# Altium project CSN_v3.PrjPCB
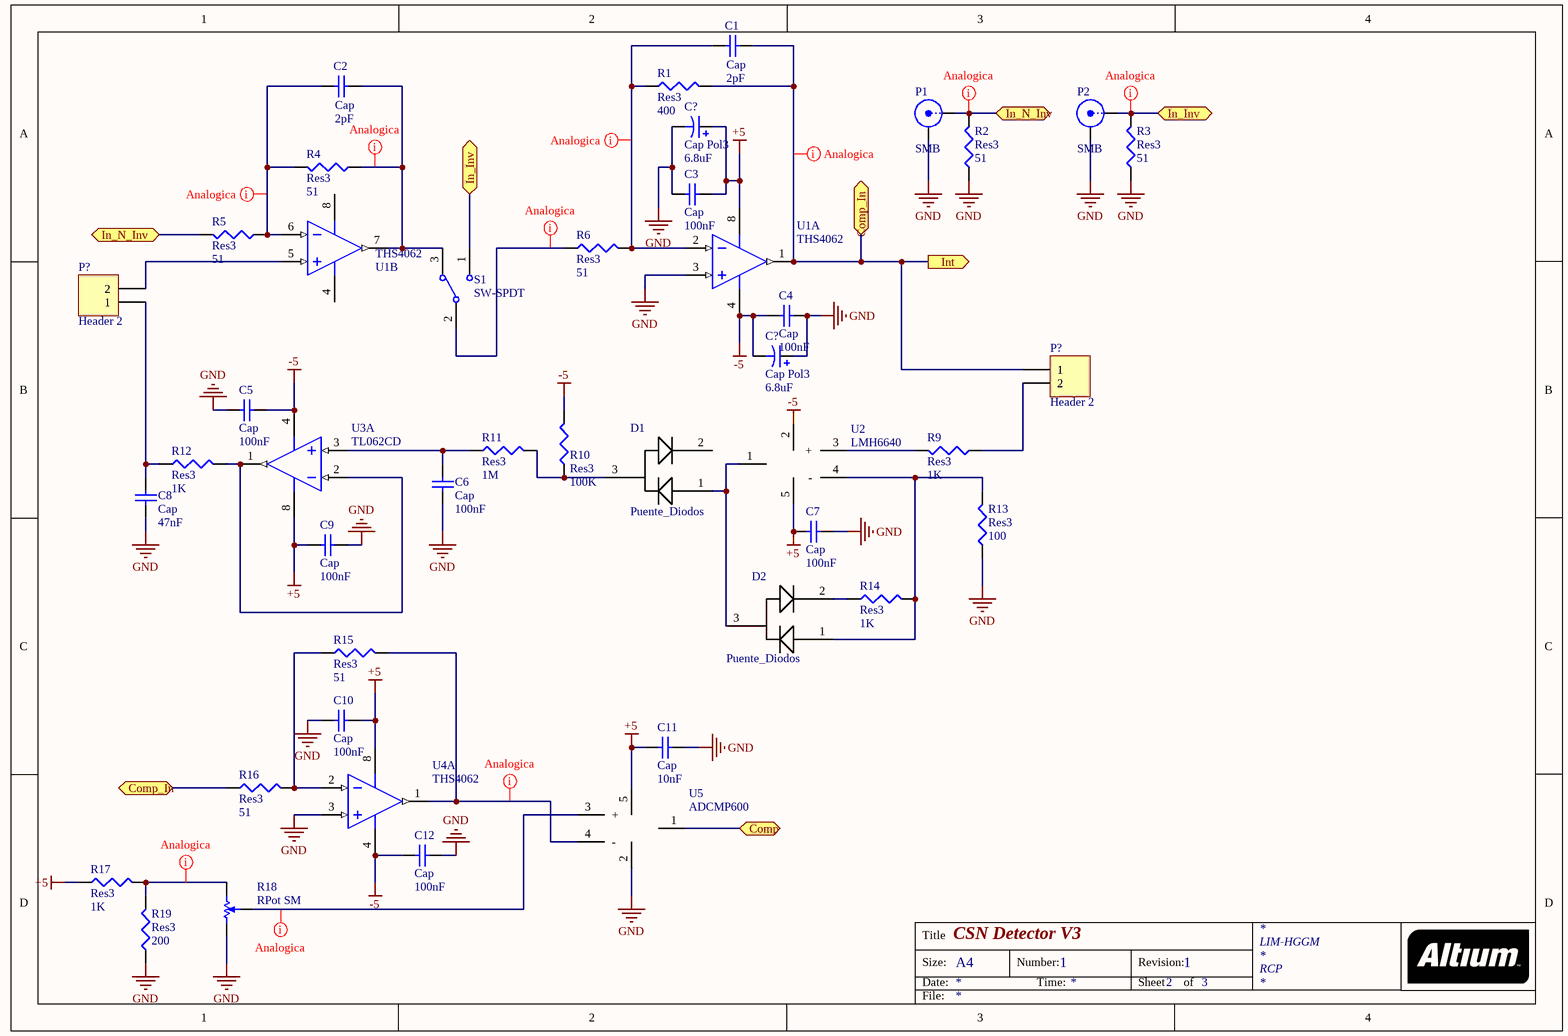
[diagram p0: Entrada_ADC.SchDoc]
3 sheets, 126 parts. Net scope: flat (ports and power ports of the same name join across sheets).
Sheets:
  Entrada_ADC.SchDoc
  Logica_ADC.SchDoc
  Hamamatsu_acond.SchDoc

## Sheet Entrada_ADC.SchDoc: CSN Detector V3
size A4; Author: RCP; CompanyName: LIM-HGM; DrawnBy: RCP; Address1: LIM-HGGM; Address3: RCP; DocumentNumber: 1; Revision: 1; SheetNumber: 2; SheetTotal: 3; PageSetup: Record=PageOptions|CenterHorizontal=True|CenterVertical=True|PrintScale=1.00|XCorrection=1.00|YCorrection=1.00|PrintKind=0|BorderSize=5000000|LeftOffset=0|BottomOffset=0|Orientation=2|PaperLength=1000|PaperWidth=1000|Scale=100|PaperSource=7|PrintQuality=-4|MediaType=1|DitherType=10|PaperKind=A4|PrintScaleMode=1

### Parts
(Parts that share a designator on the sheet are numbered #1, #2 ... from top to bottom, then left to right.)
C1  Cap  value 2pF  [6-0805_N]
C2  Cap  value 2pF  [6-0805_N]
C3  Cap  value 100nF  [6-0805_N]
C4  Cap  value 100nF  [6-0805_N]
C5  Cap  value 100nF  [6-0805_N]
C6  Cap  value 100nF  [6-0805_N]
C7  Cap  value 100nF  [6-0805_N]
C8  Cap  value 47nF  [6-0805_N]
C9  Cap  value 100nF  [6-0805_N]
C10  Cap  value 100nF  [6-0805_N]
C11  Cap  value 10nF  [6-0805_N]
C12  Cap  value 100nF  [6-0805_N]
C?#1  Cap Pol3  value 6.8uF  [C0805]
C?#2  Cap Pol3  value 6.8uF  [C0805]
D1  Puente_Diodos  [SOT-23B_N]
D2  Puente_Diodos  [SOT-23B_N]
P1  SMB  [SMB_V-RJ45]
P2  SMB  [SMB_V-RJ45]
P?#1  Header 2  [HDR1X2]
P?#2  Header 2  [HDR1X2]
R1  Res3  value 400  [6-0805_N]
R2  Res3  value 51  [6-0805_N]
R3  Res3  value 51  [6-0805_N]
R4  Res3  value 51  [6-0805_N]
R5  Res3  value 51  [6-0805_N]
R6  Res3  value 51  [6-0805_N]
R9  Res3  value 1K  [6-0805_N]
R10  Res3  value 100K  [6-0805_N]
R11  Res3  value 1M  [6-0805_N]
R12  Res3  value 1K  [6-0805_N]
R13  Res3  value 100  [6-0805_N]
R14  Res3  value 1K  [6-0805_N]
R15  Res3  value 51  [6-0805_N]
R16  Res3  value 51  [6-0805_N]
R17  Res3  value 1K  [6-0805_N]
R18  RPot SM  [POT4MM-2]
R19  Res3  value 200  [6-0805_N]
S1  SW-SPDT  [HDR1X3]
U1  THS4062  [S8_N]  (parts A,B of 2)
U2#1  LMH6640  [SOT23-5_N]
U3  TL062CD  [S8_N]  (part A of 2)
U4  THS4062  [S8_N]  (part A of 2)
U5#1  ADCMP600  [SOT23-5_N]

### Ports
Comp, Comp_In, In_Inv, In_N_Inv, Int (out)

### Nets
+5: C3.2 C7.1 C9.2 C10.2 C11.1 C?#1.1 R17.1 U1.8(V+) U2#1.5 U3.8(V+) U4.8(V+) U5#1.5
-5: C4.1 C5.1 C12.1 C?#2.2 R10.2 U1.4(V-) U2#1.2 U3.4(V-) U4.4(V-)
GND: C3.1 C4.2 C5.2 C6.2 C7.2 C8.2 C9.1 C10.1 C11.2 C12.2 C?#1.2 C?#2.1 P1.2(Y) P2.2(Y) R2.1 R3.1 R13.1 R18.CCW(-) R19.1 U1.3(IN+) U4.3(IN+) U5#1.2
NetC1_1: C1.1 R1.1 R6.2 U1.2(IN-)
NetC1_2: C1.2 P?#2.1 R1.2 R16.1 U1.1(OUT) ; port Int, port Comp_In
NetC2_1: C2.1 R4.2 R5.1 U1.6(IN-)
NetC2_2: C2.2 R4.1 S1.3 U1.7(OUT)
NetC6_1: C6.1 R11.1 U3.3(IN+)
NetC8_1: C8.1 P?#1.1 R12.1
NetC?#11_2: P1.1(X) R2.2 R5.2 ; port In_N_Inv
NetD1_1: D1.1 D2.3 U2#1.1
NetD1_3: D1.3 R10.1 R11.2
NetD2_1: D2.1 R13.2 R14.2 U2#1.4(-)
NetD2_2: D2.2 R14.1
NetP2_1: P2.1(X) R3.2 S1.1 ; port In_Inv
NetP5_6: U5#1.1 ; port Comp
NetP?#1_2: P?#1.2 U1.5(IN+)
NetP?#2_2: P?#2.2 R9.1
NetR6_1: R6.1 S1.2
NetR9_2: R9.2 U2#1.3(+)
NetR12_2: R12.2 U3.1(OUT) U3.2(IN-)
NetR15_1: R15.1 R16.2 U4.2(IN-)
NetR15_2: R15.2 U4.1(OUT) U5#1.4(-)
NetR17_2: R17.2 R18.CW(+) R19.2
NetR18_W: R18.W U5#1.3(+)

Not connected (* = marked no-connect by the designer): D1 2

### Layout directives
net class analog: NetC1_1, NetC1_2, NetC2_1, NetC2_2, NetC?#11_2, NetP2_1, NetR6_1, NetR15_2, NetR17_2, NetR18_W

### Notes on the sheet
- Title
- Size:
- Date:
- A4
- Number:
- Time:
- Revision:
- Sheet
- of
- File:

### Library data of the parts
C1-C12 = Cap: Capacitor; Published: 8-Jun-2000; LatestRevisionDate: 17-Jul-2002; LatestRevisionNote: Re-released for DXP Platform.; PackageReference: RAD-0.3; Publisher: Altium Limited; PackageDescription: Radial Cap, Thru-Hole; 2 Leads; 0.3 in Pin Spacing
C?#1 C?#2 = Cap Pol3: Polarized Capacitor (Surface Mount); Published: 8-Jun-2000; LatestRevisionDate: 29-May-2009; LatestRevisionNote: IPC-7351 Footprint Added.; PackageReference: C0805; Publisher: Altium Limited; PackageDescription: Chip Capacitor
P1 P2 = SMB: SMB Straight Connector; LatestRevisionDate: 17-Jul-2002; LatestRevisionNote: Re-released for DXP Platform.; Publisher: Altium Limited
P?#1 P?#2 = Header 2: Header, 2-Pin; LatestRevisionDate: 17-Jul-2002; LatestRevisionNote: Re-released for DXP Platform.; Publisher: Altium Limited
R1-R6 R9-R17 R19 = Res3: Resistor; Published: 8-Jun-2000; LatestRevisionDate: 29-May-2009; LatestRevisionNote: IPC-7351 Footprint Added.; PackageReference: J1-0603; Publisher: Altium Limited; PackageDescription: Chip Resistor
R18 = RPot SM: Square Trimming Potentiometer; Published: 17-Dec-2003; DatasheetVersion: Oct-2003; PackageReference: POT4MM-2; Publisher: Altium Limited; PackageDescription: Square Trimming Potentiometer; ComponentLink1Description: Manufacturer Link; ComponentLink1URL: http://bourns.com/2/search.html
S1 = SW-SPDT: SPDT Subminiature Toggle Switch, Right Angle Mounting, Vertical Actuation; Published: 24-Mar-1999; LatestRevisionDate: 17-Dec-2003; LatestRevisionNote: Schematic revised, PCB Footprint replaced.; DatasheetVersion: 05-Dec-2000; PackageReference: TL36WW15050; Publisher: Altium Limited; PackageDescription: Switch; 4 Leads; ComponentLink1Description: Manufacturer Link; ComponentLink1URL: http://www.apem.com
U1 U3 U4 = LT1253CS8: Low Cost Dual Video Amplifier; Note: 1003; Published: 8-Jun-2000; LatestRevisionDate: 13-Apr-2006; LatestRevisionNote: IPC-7351 Footprint Added.; DatasheetVersion: 1996; PackageReference: S8; Publisher: Altium Limited; PackageDescription: 8-Pin Small Outline Integrated Circuit 1.27 mm Pitch; Code_JEDEC: MS-012-AA; Code_IPC: SOIC127P600-8; ComponentLink1Description: Manufacturer Link; ComponentLink1URL: http://www.linear.com/; ComponentLink2Description: Datasheet; ComponentLink2URL: http://www.linear.com/pc/downloadDocument.do?navId=H0,C1,C1154,C1009,C1022,P1423,D1129
U2#1 = ADCMP600

## Sheet Logica_ADC.SchDoc: CSN Detector V3
size A4; CheckedBy: RCP; Author: RCP; DrawnBy: RCP; Address1: LIM-HGGM; Address3: RCP; DocumentNumber: 1; Revision: 1; SheetNumber: 3; SheetTotal: 3; PageSetup: Record=PageOptions|CenterHorizontal=True|CenterVertical=True|PrintScale=1.00|XCorrection=1.00|YCorrection=1.00|PrintKind=0|BorderSize=5000000|LeftOffset=0|BottomOffset=0|Orientation=2|PaperLength=1000|PaperWidth=1000|Scale=100|PaperSource=7|PrintQuality=-4|MediaType=1|DitherType=10|PaperKind=A4|PrintScaleMode=1
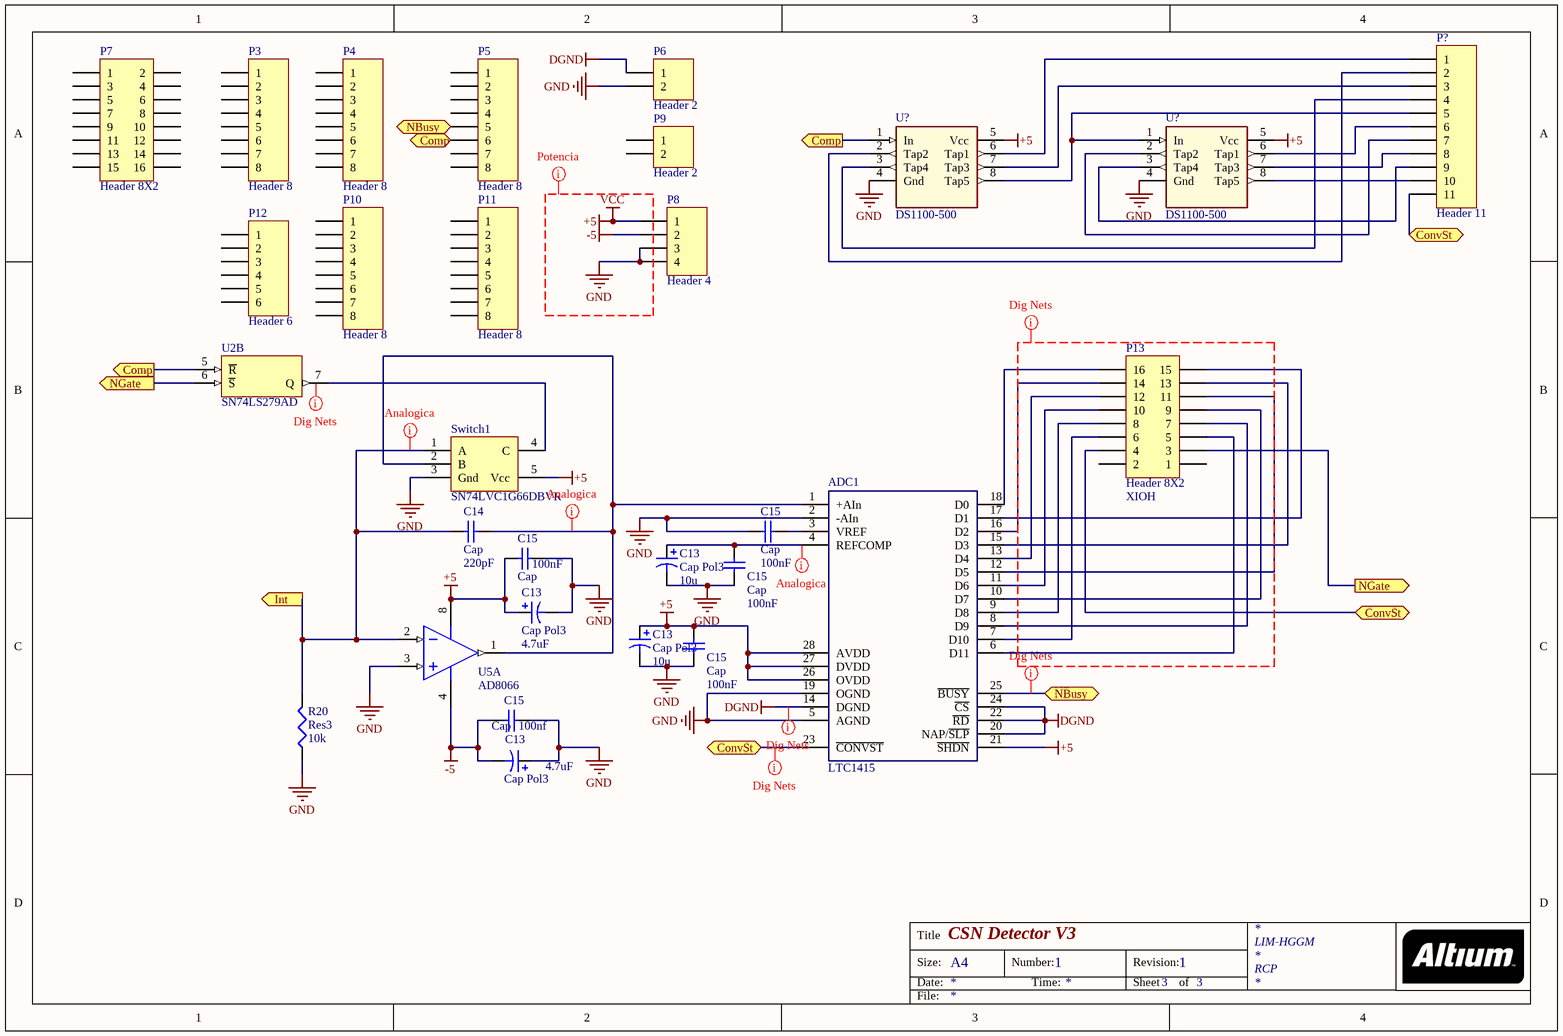
[diagram p1: Logica_ADC.SchDoc]

### Parts
(Parts that share a designator on the sheet are numbered #1, #2 ... from top to bottom, then left to right.)
ADC1  LTC1415  [SO28_N]
C13#1  Cap Pol3  value 10u  [C0805]
C13#2  Cap Pol3  value 4.7uF  [C0805]
C13#3  Cap Pol3  value 10u  [C0805]
C13#4  Cap Pol3  value 4.7uF  [C0805]
C14  Cap  value 220pF  [6-0805_N]
C15#1  Cap  value 100nF  [6-0805_N]
C15#2  Cap  value 100nF  [6-0805_N]
C15#3  Cap  value 100nF  [6-0805_N]
C15#4  Cap  value 100nF  [6-0805_N]
C15#5  Cap  value 100nf  [6-0805_N]
P3  Header 8  [HDR1X8]
P4  Header 8  [HDR1X8]
P5  Header 8  [HDR1X8]
P6  Header 2  [HDR1X2]
P7  Header 8X2  [HDR2X8]
P8  Header 4  [HDR1X4]
P9  Header 2  [HDR1X2]
P10  Header 8  [HDR1X8]
P11  Header 8  [HDR1X8]
P12  Header 6  [HDR1X6]
P13  Header 8X2  Con_Arduino: XIOH  [HDR2X8]
P?#3  Header 11  [HDR1X11]
R20  Res3  value 10k  [6-0805_N]
Switch1  SN74LVC1G66DBVR  [SOT23-5_N]
U2#2  SN74LS279AD  [D016_N]  (part B of 4)
U5#2  AD8066  [S8_N]  (part A of 2)
U?#1  DS1100-500  [SO-8_L]
U?#2  DS1100-500  [SO-8_L]

### Ports
Comp (out), ConvSt, Int (out), NBusy, NGate (out)

### Nets
+5: ADC1.21(~{SHDN}) ADC1.26(OVDD) ADC1.27(DVDD) ADC1.28(AVDD) C13#2.1 C13#3.1 C15#2.2 C15#4.2 P8.1 Switch1.5(Vcc) U2#2.16(VCC) U5#2.8(V+) U?#1.5(Vcc) U?#2.5(Vcc)  [also labelled VCC]
-5: C13#4.2 C15#5.1 P8.2 U5#2.4(V-)
DGND: ADC1.14(DGND) ADC1.20(NAP/~{SLP}) ADC1.22(~{RD}) ADC1.24(~{CS}) P6.1
GND: ADC1.2(-AIn) ADC1.5(AGND) ADC1.19(OGND) C13#1.2 C13#2.2 C13#3.2 C13#4.1 C15#1.2 C15#2.1 C15#3.1 C15#4.1 C15#5.2 P6.2 P8.3 P8.4 R20.1 Switch1.3(Gnd) U2#2.8(GND) U5#2.3(IN+) U?#1.4(Gnd) U?#2.4(Gnd)
NetADC1_1: ADC1.1(+AIn) C14.2 Switch1.2(B) U5#2.1(OUT)
NetADC1_3: ADC1.3(VREF) C15#1.1
NetADC1_4: ADC1.4(REFCOMP) C13#1.1 C15#3.2
NetADC1_6: ADC1.6(D11) P13.5
NetADC1_7: ADC1.7(D10) P13.6
NetADC1_8: ADC1.8(D9) P13.7
NetADC1_9: ADC1.9(D8) P13.8
NetADC1_10: ADC1.10(D7) P13.9
NetADC1_11: ADC1.11(D6) P13.10
NetADC1_12: ADC1.12(D5) P13.11
NetADC1_13: ADC1.13(D4) P13.12
NetADC1_15: ADC1.15(D3) P13.13
NetADC1_16: ADC1.16(D2) P13.14
NetADC1_17: ADC1.17(D1) P13.15
NetADC1_18: ADC1.18(D0) P13.16
NetADC1_23: ADC1.23(~{CONVST}) P13.4 P?#3.11 ; port ConvSt
NetADC1_25: ADC1.25(~{BUSY}) P5.5 ; port NBusy
NetC1_2: C14.1 R20.2 Switch1.1(A) U5#2.2(IN-) ; port Int
NetP5_6: P5.6 U2#2.5(~{R}) U?#1.1(In) ; port Comp
NetP13_3: P13.3 U2#2.6(~{S}) ; port NGate
NetP?#3_1: P?#3.1 U?#1.6(Tap1)
NetP?#3_2: P?#3.2 U?#1.2(Tap2)
NetP?#3_3: P?#3.3 U?#1.7(Tap3)
NetP?#3_4: P?#3.4 U?#1.3(Tap4)
NetP?#3_5: P?#3.5 U?#1.8(Tap5) U?#2.1(In)
NetP?#3_6: P?#3.6 U?#2.6(Tap1)
NetP?#3_7: P?#3.7 U?#2.2(Tap2)
NetP?#3_8: P?#3.8 U?#2.7(Tap3)
NetP?#3_9: P?#3.9 U?#2.3(Tap4)
NetP?#3_10: P?#3.10 U?#2.8(Tap5)
NetSwitch1_4: Switch1.4(C) U2#2.7(Q)

Not connected (* = marked no-connect by the designer): P3 1 2 3 4 5 6 7 8; P4 1 2 3 4 5 6 7 8; P5 1 2 3 4 7 8; P7 1 2 3 4 5 6 7 8 9 10 11 12 13 14 15 16; P9 1 2; P10 1 2 3 4 5 6 7 8; P11 1 2 3 4 5 6 7 8; P12 1 2 3 4 5 6; P13 1 2

### Layout directives
net class digital: (no net found under the mark), DGND, NetADC1_23, NetADC1_25
net class potencia: +5, -5, GND, VCC
net class analog: NetADC1_1, NetADC1_4, NetC1_2

### Notes on the sheet
- Title
- Size:
- Date:
- A4
- Number:
- Time:
- Revision:
- Sheet
- of
- File:

### Library data of the parts
C13#1-C13#4 = Cap Pol3: Polarized Capacitor (Surface Mount); Published: 8-Jun-2000; LatestRevisionDate: 29-May-2009; LatestRevisionNote: IPC-7351 Footprint Added.; PackageReference: C0805; Publisher: Altium Limited; PackageDescription: Chip Capacitor
C14 C15#1-C15#5 = Cap: Capacitor; Published: 8-Jun-2000; LatestRevisionDate: 17-Jul-2002; LatestRevisionNote: Re-released for DXP Platform.; PackageReference: RAD-0.3; Publisher: Altium Limited; PackageDescription: Radial Cap, Thru-Hole; 2 Leads; 0.3 in Pin Spacing
P3-P5 P10 P11 = Header 8: Header, 8-Pin; LatestRevisionDate: 17-Jul-2002; LatestRevisionNote: Re-released for DXP Platform.; Publisher: Altium Limited
P6 P9 = Header 2: Header, 2-Pin; LatestRevisionDate: 17-Jul-2002; LatestRevisionNote: Re-released for DXP Platform.; Publisher: Altium Limited
P7 P13 = Header 8X2: Header, 8-Pin, Dual row; LatestRevisionDate: 17-Jul-2002; LatestRevisionNote: Re-released for DXP Platform.; Publisher: Altium Limited
P8 = Header 4: Header, 4-Pin; LatestRevisionDate: 17-Jul-2002; LatestRevisionNote: Re-released for DXP Platform.; Publisher: Altium Limited
P12 = Header 6: Header, 6-Pin; LatestRevisionDate: 17-Jul-2002; LatestRevisionNote: Re-released for DXP Platform.; Publisher: Altium Limited
P?#3 = Header 11: Header, 11-Pin; LatestRevisionDate: 17-Jul-2002; LatestRevisionNote: Re-released for DXP Platform.; Publisher: Altium Limited
R20 = Res3: Resistor; Published: 8-Jun-2000; LatestRevisionDate: 29-May-2009; LatestRevisionNote: IPC-7351 Footprint Added.; PackageReference: J1-0603; Publisher: Altium Limited; PackageDescription: Chip Resistor
U2#2 = SN74LS279AD: Quadruple S-R Latches; Published: 8-Jun-2000; LatestRevisionDate: 13-Apr-2006; LatestRevisionNote: IPC-7351 Footprint Added.; DatasheetVersion: Mar-1988; PackageVersion: Jan-1998; PackageReference: D016; Publisher: Altium Limited; PackageDescription: 16-Pin Small Outline Integrated Circuit 1.27 mm Pitch; Code_IPC: SOIC127P600-16; ComponentLink1Description: Manufacturer Link; ComponentLink1URL: http://www.ti.com/; ComponentLink2Description: Datasheet; ComponentLink2URL: http://www-s.ti.com/sc/ds/sn54279.pdf
U5#2 = LT1253CS8: as U1 on sheet Entrada_ADC; Published: 8-Jun-2000; LatestRevisionDate: 13-Apr-2006; LatestRevisionNote: IPC-7351 Footprint Added.; DatasheetVersion: 1996; PackageReference: S8; Publisher: Altium Limited; PackageDescription: 8-Pin Small Outline Integrated Circuit 1.27 mm Pitch; Code_JEDEC: MS-012-AA; Code_IPC: SOIC127P600-8; ComponentLink1Description: Manufacturer Link; ComponentLink1URL: http://www.linear.com/; ComponentLink2Description: Datasheet; ComponentLink2URL: http://www.linear.com/pc/downloadDocument.do?navId=H0,C1,C1154,C1009,C1022,P1423,D1129

## Sheet Hamamatsu_acond.SchDoc: CSN Detector V3
size A4; Author: RCP; DrawnBy: RCP; Address1: LIM-HGGM; Address3: RCP; DocumentNumber: 1; Revision: 1; SheetNumber: 1; SheetTotal: 3; PageSetup: Record=PageOptions|CenterHorizontal=True|CenterVertical=True|PrintScale=1.00|XCorrection=1.00|YCorrection=1.00|PrintKind=0|BorderSize=5000000|LeftOffset=0|BottomOffset=0|Orientation=2|PaperLength=1000|PaperWidth=1000|Scale=100|PaperSource=7|PrintQuality=-4|MediaType=1|DitherType=10|PaperKind=A4|PrintScaleMode=1
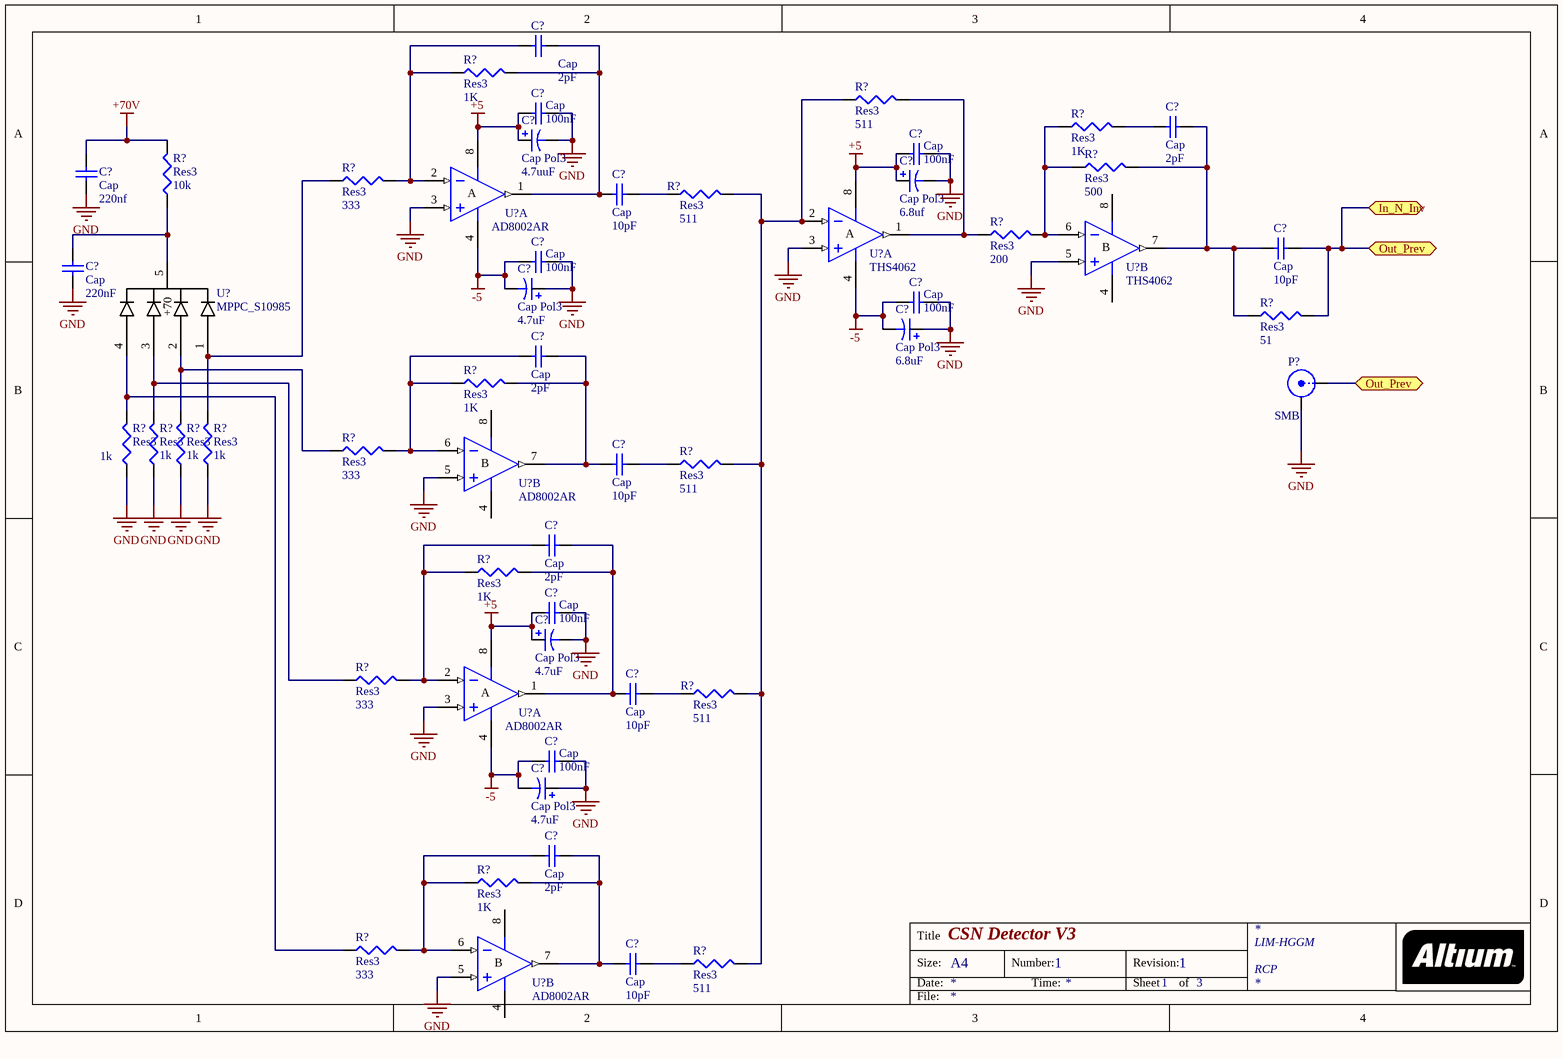
[diagram p2: Hamamatsu_acond.SchDoc]

### Parts
(Parts that share a designator on the sheet are numbered #1, #2 ... from top to bottom, then left to right.)
C?#3  Cap  value 2pF  [C0805]
C?#4  Cap  value 2pF  [C0805]
C?#5  Cap Pol3  value 4.7uuF  [C0805]
C?#6  Cap  value 100nF  [6-0805_N]
C?#7  Cap Pol3  value 6.8uf  [C0805]
C?#8  Cap  value 100nF  [6-0805_N]
C?#9  Cap  value 220nf  [C0805]
C?#10  Cap  value 10pF  [C0805]
C?#11  Cap  value 10pF  [C0805]
C?#12  Cap  value 220nF  [C0805]
C?#13  Cap  value 100nF  [6-0805_N]
C?#14  Cap Pol3  value 4.7uF  [C0805]
C?#15  Cap  value 100nF  [6-0805_N]
C?#16  Cap  value 2pF  [C0805]
C?#17  Cap Pol3  value 6.8uF  [C0805]
C?#18  Cap  value 10pF  [C0805]
C?#19  Cap  value 2pF  [C0805]
C?#20  Cap Pol3  value 4.7uF  [C0805]
C?#21  Cap  value 100nF  [6-0805_N]
C?#22  Cap  value 10pF  [C0805]
C?#23  Cap  value 100nF  [6-0805_N]
C?#24  Cap Pol3  value 4.7uF  [C0805]
C?#25  Cap  value 2pF  [C0805]
C?#26  Cap  value 10pF  [C0805]
P?#4  SMB  [SMB_V-RJ45]
R?#1  Res3  value 1K  [6-0805_N]
R?#2  Res3  value 511  [6-0805_N]
R?#3  Res3  value 1K  [6-0805_N]
R?#4  Res3  value 500  [6-0805_N]
R?#5  Res3  value 333  [6-0805_N]
R?#6  Res3  value 511  [6-0805_N]
R?#7  Res3  value 10k  [6-0805_N]
R?#8  Res3  value 200  [6-0805_N]
R?#9  Res3  value 51  [6-0805_N]
R?#10  Res3  value 1K  [6-0805_N]
R?#11  Res3  value 333  [6-0805_N]
R?#12  Res3  value 511  [6-0805_N]
R?#13  Res3  value 1k  [6-0805_N]
R?#14  Res3  value 1k  [6-0805_N]
R?#15  Res3  value 1k  [6-0805_N]
R?#16  Res3  value 1k  [6-0805_N]
R?#17  Res3  value 1K  [6-0805_N]
R?#18  Res3  value 333  [6-0805_N]
R?#19  Res3  value 511  [6-0805_N]
R?#20  Res3  value 1K  [6-0805_N]
R?#21  Res3  value 333  [6-0805_N]
R?#22  Res3  value 511  [6-0805_N]
U?#3  AD8002AR  [SO-8_M]  (part A of 2)
U?#4  THS4062  [SO-8_M]  (part A of 2)
U?#5  THS4062  [SO-8_M]  (part B of 2)
U?#6  MPPC_S10985  [S10985_HAM]
U?#7  AD8002AR  [SO-8_M]  (part B of 2)
U?#8  AD8002AR  [SO-8_M]  (part A of 2)
U?#9  AD8002AR  [SO-8_M]  (part B of 2)

### Ports
In_N_Inv, Out_Prev

### Nets
+5: C?#5.1 C?#6.2 C?#7.1 C?#8.2 C?#20.1 C?#21.2 U?#3.8(V+) U?#4.8(V+) U?#8.8(V+)
+70V: C?#9.2 R?#7.2
-5: C?#13.2 C?#14.2 C?#15.2 C?#17.2 C?#23.2 C?#24.2 U?#3.4(V-) U?#4.4(V-) U?#8.4(V-)
GND: C?#5.2 C?#6.1 C?#7.2 C?#8.1 C?#9.1 C?#12.1 C?#13.1 C?#14.1 C?#15.1 C?#17.1 C?#20.2 C?#21.1 C?#23.1 C?#24.1 P?#4.2(Y) R?#13.1 R?#14.1 R?#15.1 R?#16.1 U?#3.3(IN+) U?#4.3(IN+) U?#5.5(IN+) U?#7.5(IN+) U?#8.3(IN+) U?#9.5(IN+)
NetC?#3_1: C?#3.1 R?#1.1 R?#5.2 U?#3.2(IN-)
NetC?#3_2: C?#3.2 C?#10.1 R?#1.2 U?#3.1(OUT)
NetC?#4_1: C?#4.1 R?#3.2
NetC?#4_2: C?#4.2 C?#11.1 R?#4.2 R?#9.1 U?#5.7(OUT)
NetC?#10_2: C?#10.2 R?#6.1
NetC?#11_2: C?#11.2 P?#4.1(X) R?#9.2 ; port Out_Prev, port In_N_Inv
NetC?#12_2: C?#12.2 R?#7.1 U?#6.5(+70)
NetC?#16_1: C?#16.1 R?#10.1 R?#11.2 U?#7.6(IN-)
NetC?#16_2: C?#16.2 C?#18.1 R?#10.2 U?#7.7(OUT)
NetC?#18_2: C?#18.2 R?#12.1
NetC?#19_1: C?#19.1 R?#17.1 R?#18.2 U?#8.2(IN-)
NetC?#19_2: C?#19.2 C?#22.1 R?#17.2 U?#8.1(OUT)
NetC?#22_2: C?#22.2 R?#19.1
NetC?#25_1: C?#25.1 R?#20.1 R?#21.2 U?#9.6(IN-)
NetC?#25_2: C?#25.2 C?#26.1 R?#20.2 U?#9.7(OUT)
NetC?#26_2: C?#26.2 R?#22.1
NetR?#2_1: R?#2.1 R?#6.2 R?#12.2 R?#19.2 R?#22.2 U?#4.2(IN-)
NetR?#2_2: R?#2.2 R?#8.1 U?#4.1(OUT)
NetR?#3_1: R?#3.1 R?#4.1 R?#8.2 U?#5.6(IN-)
NetR?#5_1: R?#5.1 R?#16.2 U?#6.1(Pin1)
NetR?#11_1: R?#11.1 R?#15.2 U?#6.2(Pin2)
NetR?#13_2: R?#13.2 R?#21.1 U?#6.4
NetR?#14_2: R?#14.2 R?#18.1 U?#6.3

Not connected (* = marked no-connect by the designer): U?#5 4(V-) 8(V+); U?#7 4(V-) 8(V+); U?#9 4(V-) 8(V+)

### Notes on the sheet
- Title
- Size:
- Date:
- A4
- Number:
- Time:
- Revision:
- Sheet
- of
- File:
- (in symbol AD8002AR, part A) A
- (in symbol AD8002AR, part B) B

### Library data of the parts
C?#3 C?#4 C?#6 C?#8-C?#13 C?#15 C?#16 C?#18 C?#19 C?#21-C?#23 C?#25 C?#26 = Cap: Capacitor; Published: 8-Jun-2000; LatestRevisionDate: 17-Jul-2002; LatestRevisionNote: Re-released for DXP Platform.; PackageReference: RAD-0.3; Publisher: Altium Limited; PackageDescription: Radial Cap, Thru-Hole; 2 Leads; 0.3 in Pin Spacing
C?#5 C?#7 C?#14 C?#17 C?#20 C?#24 = Cap Pol3: Polarized Capacitor (Surface Mount); Published: 8-Jun-2000; LatestRevisionDate: 29-May-2009; LatestRevisionNote: IPC-7351 Footprint Added.; PackageReference: C0805; Publisher: Altium Limited; PackageDescription: Chip Capacitor
P?#4 = SMB: SMB Straight Connector; LatestRevisionDate: 17-Jul-2002; LatestRevisionNote: Re-released for DXP Platform.; Publisher: Altium Limited
R?#1-R?#22 = Res3: Resistor; Published: 8-Jun-2000; LatestRevisionDate: 29-May-2009; LatestRevisionNote: IPC-7351 Footprint Added.; PackageReference: J1-0603; Publisher: Altium Limited; PackageDescription: Chip Resistor
U?#3-U?#5 U?#7-U?#9 = AD8002AR: Dual 600MHz, 50mW Current Feedback Amplifier; Published: 8-Jun-2000; LatestRevisionDate: 13-Apr-2006; LatestRevisionNote: IPC-7351 Footprint Added.; DatasheetVersion: REV. C 1999; PackageVersion: revA; PackageReference: SO-8; Publisher: Altium Limited; PackageDescription: 8-Pin Small Outline Integrated Circuit 1.27 mm Pitch; Code_JEDEC: MS-012-AA; Code_IPC: SOIC127P600-8; ComponentLink1Description: Manufacturer Link; ComponentLink1URL: http://www.analog.com/en/prod/0,,759_786_AD8002%2C00.html; ComponentLink2Description: Datasheet; ComponentLink2URL: http://www.analog.com/UploadedFiles/Data_Sheets/147523773AD8002_d.pdf

## Nets that join several sheets
+5: Entrada_ADC (12 pins), Logica_ADC (14 pins), Hamamatsu_acond (9 pins)
-5: Entrada_ADC (9 pins), Logica_ADC (C13#4.2 C15#5.1 P8.2 U5#2.4), Hamamatsu_acond (9 pins)
GND: Entrada_ADC (22 pins), Logica_ADC (21 pins), Hamamatsu_acond (25 pins)
NetC1_2: Entrada_ADC (5 pins), Logica_ADC (C14.1 R20.2 Switch1.1 U5#2.2)
NetC?#11_2: Entrada_ADC (P1.1 R2.2 R5.2), Hamamatsu_acond (C?#11.2 P?#4.1 R?#9.2)
NetP5_6: Entrada_ADC (U5#1.1), Logica_ADC (P5.6 U2#2.5 U?#1.1)